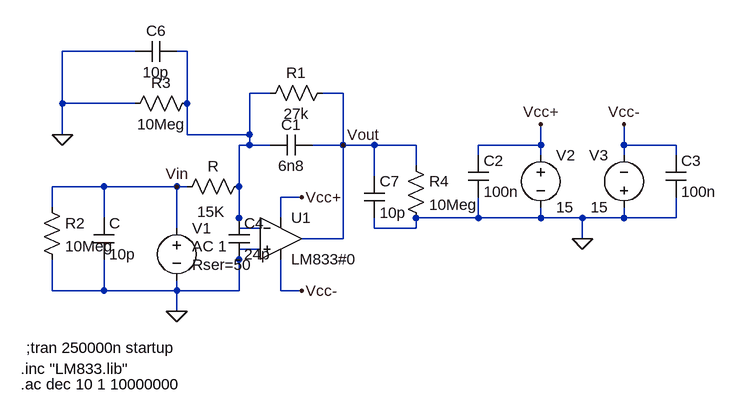
[diagram p0: schematic tp2ej4integ.asc]
tp2ej4integ.asc, the LTspice schematic file:
Version 4
SHEET 1 880 680
WIRE -464 -384 -576 -384
WIRE -384 -384 -400 -384
WIRE -256 -320 -288 -320
WIRE -144 -320 -176 -320
WIRE -576 -304 -576 -384
WIRE -464 -304 -576 -304
WIRE -384 -304 -384 -384
WIRE -576 -256 -576 -304
WIRE -384 -256 -384 -304
WIRE -288 -256 -288 -320
WIRE -288 -256 -384 -256
WIRE -288 -240 -288 -256
WIRE -288 -240 -304 -240
WIRE -256 -240 -288 -240
WIRE -144 -240 -144 -320
WIRE -144 -240 -192 -240
WIRE -96 -240 -144 -240
WIRE -32 -240 -96 -240
WIRE 160 -240 160 -272
WIRE 160 -240 64 -240
WIRE 288 -240 288 -272
WIRE 368 -240 288 -240
WIRE 64 -224 64 -240
WIRE 160 -224 160 -240
WIRE 288 -224 288 -240
WIRE 368 -224 368 -240
WIRE -32 -208 -32 -240
WIRE -96 -192 -96 -240
WIRE -512 -176 -592 -176
WIRE -400 -176 -512 -176
WIRE -384 -176 -400 -176
WIRE -304 -176 -304 -240
WIRE -208 -160 -240 -160
WIRE -592 -144 -592 -176
WIRE -512 -128 -512 -176
WIRE -304 -128 -304 -176
WIRE -240 -128 -240 -160
WIRE 64 -128 64 -160
WIRE 64 -128 -32 -128
WIRE 160 -128 160 -144
WIRE 160 -128 64 -128
WIRE 224 -128 160 -128
WIRE 288 -128 288 -144
WIRE 288 -128 224 -128
WIRE 368 -128 368 -160
WIRE 368 -128 288 -128
WIRE -400 -112 -400 -176
WIRE -304 -112 -304 -128
WIRE -272 -112 -304 -112
WIRE -96 -112 -96 -128
WIRE -32 -112 -32 -128
WIRE -32 -112 -96 -112
WIRE -144 -96 -144 -240
WIRE -144 -96 -208 -96
WIRE 224 -96 224 -128
WIRE -272 -80 -304 -80
WIRE -304 -64 -304 -80
WIRE -592 -16 -592 -64
WIRE -512 -16 -512 -64
WIRE -512 -16 -592 -16
WIRE -400 -16 -400 -32
WIRE -400 -16 -512 -16
WIRE -304 -16 -304 -64
WIRE -304 -16 -400 -16
WIRE -240 -16 -240 -64
WIRE -208 -16 -240 -16
WIRE -400 16 -400 -16
FLAG -400 16 0
FLAG -208 -16 Vcc-
FLAG -208 -160 Vcc+
FLAG 224 -96 0
FLAG 160 -272 Vcc+
FLAG 288 -272 Vcc-
FLAG -144 -240 Vout
FLAG -400 -176 Vin
FLAG -576 -256 0
SYMBOL cap -192 -256 R90
WINDOW 0 0 32 VBottom 2
WINDOW 3 32 32 VTop 2
SYMATTR InstName C1
SYMATTR Value 6n8
SYMBOL res -288 -192 R90
WINDOW 0 0 56 VBottom 2
WINDOW 3 39 59 VTop 2
SYMATTR InstName R
SYMATTR Value 15K
SYMBOL voltage 160 -240 R0
WINDOW 123 0 0 Left 2
WINDOW 39 0 0 Left 2
SYMATTR InstName V2
SYMATTR Value 15
SYMBOL voltage 288 -128 R180
WINDOW 0 24 96 Left 2
WINDOW 3 24 16 Left 2
WINDOW 123 0 0 Left 2
WINDOW 39 0 0 Left 2
SYMATTR InstName V3
SYMATTR Value 15
SYMBOL Opamps\\opamp2 -240 -160 R0
SYMATTR InstName U1
SYMATTR Value LM833#0
SYMBOL cap 48 -224 R0
SYMATTR InstName C2
SYMATTR Value 100n
SYMBOL cap 352 -224 R0
SYMATTR InstName C3
SYMATTR Value 100n
SYMBOL voltage -400 -128 R0
WINDOW 123 24 44 Left 2
WINDOW 39 24 72 Left 2
SYMATTR InstName V1
SYMATTR Value ""
SYMATTR Value2 AC 1
SYMATTR SpiceLine Rser=50
SYMBOL cap -320 -128 R0
SYMATTR InstName C4
SYMATTR Value 24p
SYMBOL res -160 -336 R90
WINDOW 0 0 56 VBottom 2
WINDOW 3 32 56 VTop 2
SYMATTR InstName R1
SYMATTR Value 27k
SYMBOL cap -528 -128 R0
SYMATTR InstName C
SYMATTR Value 10p
SYMBOL res -608 -160 R0
SYMATTR InstName R2
SYMATTR Value 10Meg
SYMBOL res -368 -320 R90
WINDOW 0 0 56 VBottom 2
WINDOW 3 32 56 VTop 2
SYMATTR InstName R3
SYMATTR Value 10Meg
SYMBOL cap -400 -400 R90
WINDOW 0 0 32 VBottom 2
WINDOW 3 32 32 VTop 2
SYMATTR InstName C6
SYMATTR Value 10p
SYMBOL cap -112 -192 R0
SYMATTR InstName C7
SYMATTR Value 10p
SYMBOL res -48 -224 R0
SYMATTR InstName R4
SYMATTR Value 10Meg
TEXT -640 128 Left 2 !.ac dec 10 1 10000000
TEXT -640 104 Left 2 !.inc "LM833.lib"
TEXT -632 72 Left 2 !;tran 250000n startup

The netlist it stands for:
* tp2ej4integ.asc
C1 Vout N001 6n8
R N001 Vin 15K
V2 Vcc+ 0 15
V3 0 Vcc- 15
XU1 0 N001 Vcc+ Vcc- Vout LM833#0  ; pins In+ In- V+ V- OUT
C2 Vcc+ 0 100n
C3 Vcc- 0 100n
V1 Vin 0 AC 1 Rser=50
C4 N001 0 24p
R1 Vout N001 27k
C Vin 0 10p
R2 Vin 0 10Meg
R3 N001 0 10Meg
C6 N001 0 10p
C7 Vout 0 10p
R4 Vout 0 10Meg
.ac dec 10 1 10000000
.inc "LM833.lib"
;tran 250000n startup
.backanno
.end